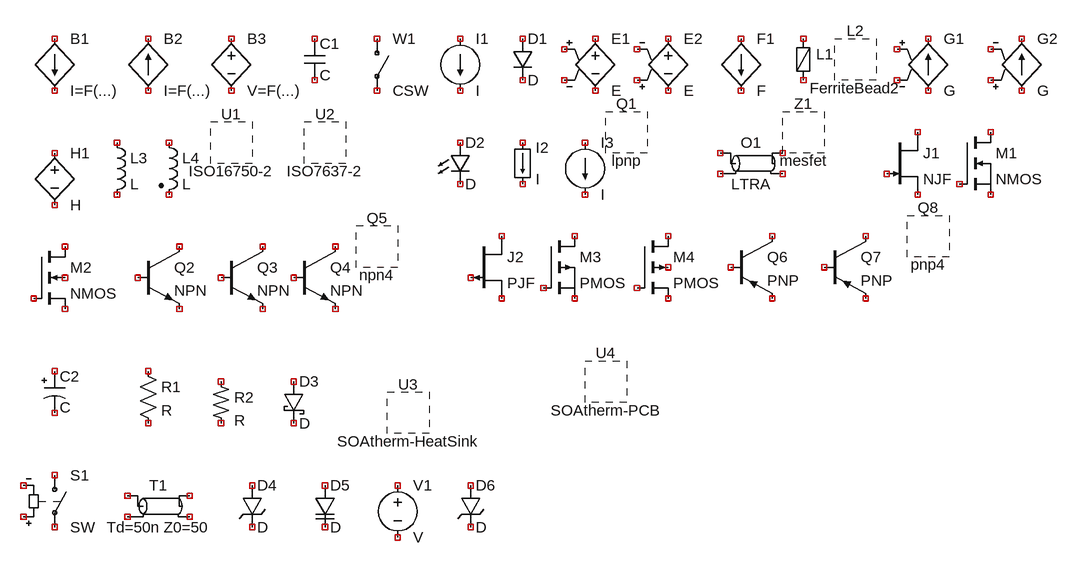
[diagram p0: schematic allLTSpiceMainSymbols.asc]
allLTSpiceMainSymbols.asc, the LTspice schematic file:
Version 4
SHEET 1 1192 680
SYMBOL bi -400 -176 R0
SYMATTR InstName B1
SYMBOL bi2 -256 -176 R0
SYMATTR InstName B2
SYMBOL bv -128 -192 R0
SYMATTR InstName B3
SYMBOL cap -16 -176 R0
SYMATTR InstName C1
SYMBOL csw 96 -176 R0
SYMATTR InstName W1
SYMBOL current 224 -176 R0
SYMATTR InstName I1
SYMBOL diode 304 -176 R0
SYMATTR InstName D1
SYMBOL e 432 -192 R0
SYMATTR InstName E1
SYMBOL e2 544 -192 R0
SYMATTR InstName E2
SYMBOL f 656 -176 R0
SYMATTR InstName F1
SYMBOL FerriteBead 752 -144 R0
SYMATTR InstName L1
SYMBOL FerriteBead2 832 -144 R0
SYMATTR InstName L2
SYMBOL g 944 -192 R0
SYMATTR InstName G1
SYMBOL g2 1088 -192 R0
SYMATTR InstName G2
SYMBOL h -400 -16 R0
SYMATTR InstName H1
SYMBOL ind -320 -32 R0
SYMATTR InstName L3
SYMBOL ind2 -240 -32 R0
SYMATTR InstName L4
SYMBOL ISO16750-2 -128 -16 R0
SYMATTR InstName U1
SYMBOL ISO7637-2 16 -16 R0
SYMATTR InstName U2
SYMBOL LED 208 -16 R0
SYMATTR InstName D2
SYMBOL load 304 -16 R0
SYMATTR InstName I2
SYMBOL load2 416 -16 R0
SYMATTR InstName I3
SYMBOL lpnp 480 -32 R0
SYMATTR InstName Q1
SYMBOL ltline 672 16 R0
SYMATTR InstName O1
SYMBOL mesfet 752 -32 R0
SYMATTR InstName Z1
SYMBOL njf 880 -32 R0
SYMATTR InstName J1
SYMBOL nmos 992 -32 R0
SYMATTR InstName M1
SYMBOL nmos4 -432 144 R0
SYMATTR InstName M2
SYMBOL npn -272 144 R0
SYMATTR InstName Q2
SYMBOL npn2 -144 144 R0
SYMATTR InstName Q3
SYMBOL npn3 -32 144 R0
SYMATTR InstName Q4
SYMBOL npn4 96 144 R0
SYMATTR InstName Q5
SYMBOL pjf 240 128 R0
SYMATTR InstName J2
SYMBOL pmos 352 128 R0
SYMATTR InstName M3
SYMBOL pmos4 496 128 R0
SYMATTR InstName M4
SYMBOL pnp 640 128 R0
SYMATTR InstName Q6
SYMBOL pnp2 784 128 R0
SYMATTR InstName Q7
SYMBOL pnp4 944 128 R0
SYMATTR InstName Q8
SYMBOL polcap -416 336 R0
SYMATTR InstName C2
SYMBOL res -272 320 R0
SYMATTR InstName R1
SYMBOL res2 -160 352 R0
SYMATTR InstName R2
SYMBOL schottky -48 352 R0
SYMATTR InstName D3
SYMBOL SOAtherm-HeatSink 144 400 R0
SYMATTR InstName U3
SYMBOL SOAtherm-PCB 448 352 R0
SYMATTR InstName U4
SYMBOL sw -400 480 R0
SYMATTR InstName S1
SYMBOL tline -240 544 R0
SYMATTR InstName T1
SYMBOL TVSdiode -112 512 R0
SYMATTR InstName D4
SYMBOL varactor 0 512 R0
SYMATTR InstName D5
SYMBOL voltage 128 496 R0
SYMATTR InstName V1
SYMBOL zener 224 512 R0
SYMATTR InstName D6

The netlist it stands for:
* allLTSpiceMainSymbols.asc
B1 NC_01 NC_02 I=F(...)
B2 NC_03 NC_04 I=F(...)
B3 NC_05 NC_06 V=F(...)
C1 NC_07 NC_08 C
W1 NC_09 NC_10 CSW
I1 NC_11 NC_12 I
D1 NC_13 NC_14 D
E1 NC_15 NC_16 NC_17 NC_18 E
E2 NC_19 NC_20 NC_21 NC_22 E
F1 NC_23 NC_24 F
L1 NC_25 NC_26
* L2: FerriteBead2 (symbol FerriteBead2 not available, pin order unknown); nets seen at it: 
G1 NC_27 NC_28 NC_29 NC_30 G
G2 NC_31 NC_32 NC_33 NC_34 G
H1 NC_35 NC_36 H
L3 NC_37 NC_38 L
L4 NC_39 NC_40 L
* U1: ISO16750-2 (symbol ISO16750-2 not available, pin order unknown); nets seen at it: 
* U2: ISO7637-2 (symbol ISO7637-2 not available, pin order unknown); nets seen at it: 
D2 NC_41 NC_42 D
I2 NC_43 NC_44 I
I3 NC_45 NC_46 I
* Q1: lpnp (symbol lpnp not available, pin order unknown); nets seen at it: 
O1 NC_47 NC_48 NC_49 NC_50 LTRA
* Z1: mesfet (symbol mesfet not available, pin order unknown); nets seen at it: 
J1 NC_51 NC_52 NC_53 NJF
M1 NC_54 NC_55 NC_56 NC_56 NMOS
M2 NC_57 NC_58 NC_59 NC_60 NMOS
Q2 NC_61 NC_62 NC_63 0 NPN
Q3 NC_64 NC_65 NC_66 0 NPN
Q4 NC_67 NC_68 NC_69 0 NPN
* Q5: npn4 (symbol npn4 not available, pin order unknown); nets seen at it: 
J2 NC_70 NC_71 NC_72 PJF
M3 NC_73 NC_74 NC_75 NC_75 PMOS
M4 NC_76 NC_77 NC_78 NC_79 PMOS
Q6 NC_80 NC_81 NC_82 0 PNP
Q7 NC_83 NC_84 NC_85 0 PNP
* Q8: pnp4 (symbol pnp4 not available, pin order unknown); nets seen at it: 
C2 NC_86 NC_87 C
R1 NC_88 NC_89 R
R2 NC_90 NC_91 R
D3 NC_92 NC_93 D
* U3: SOAtherm-HeatSink (symbol SOAtherm-HeatSink not available, pin order unknown); nets seen at it: 
* U4: SOAtherm-PCB (symbol SOAtherm-PCB not available, pin order unknown); nets seen at it: 
S1 NC_94 NC_95 NC_96 NC_97 SW
T1 NC_98 NC_99 NC_100 NC_101 Td=50n Z0=50
D4 NC_102 NC_103 D
D5 NC_104 NC_105 D
V1 NC_106 NC_107 V
D6 NC_108 NC_109 D
.model D D
.lib standard.dio
.model NPN NPN
.model PNP PNP
.lib standard.bjt
.model NJF NJF
.model PJF PJF
.lib standard.jft
.model NMOS NMOS
.model PMOS PMOS
.lib standard.mos
.backanno
.end